# EAGLE schematic screen.sch123 (EAGLE 9.6.1)

## Sheet 1 of 4
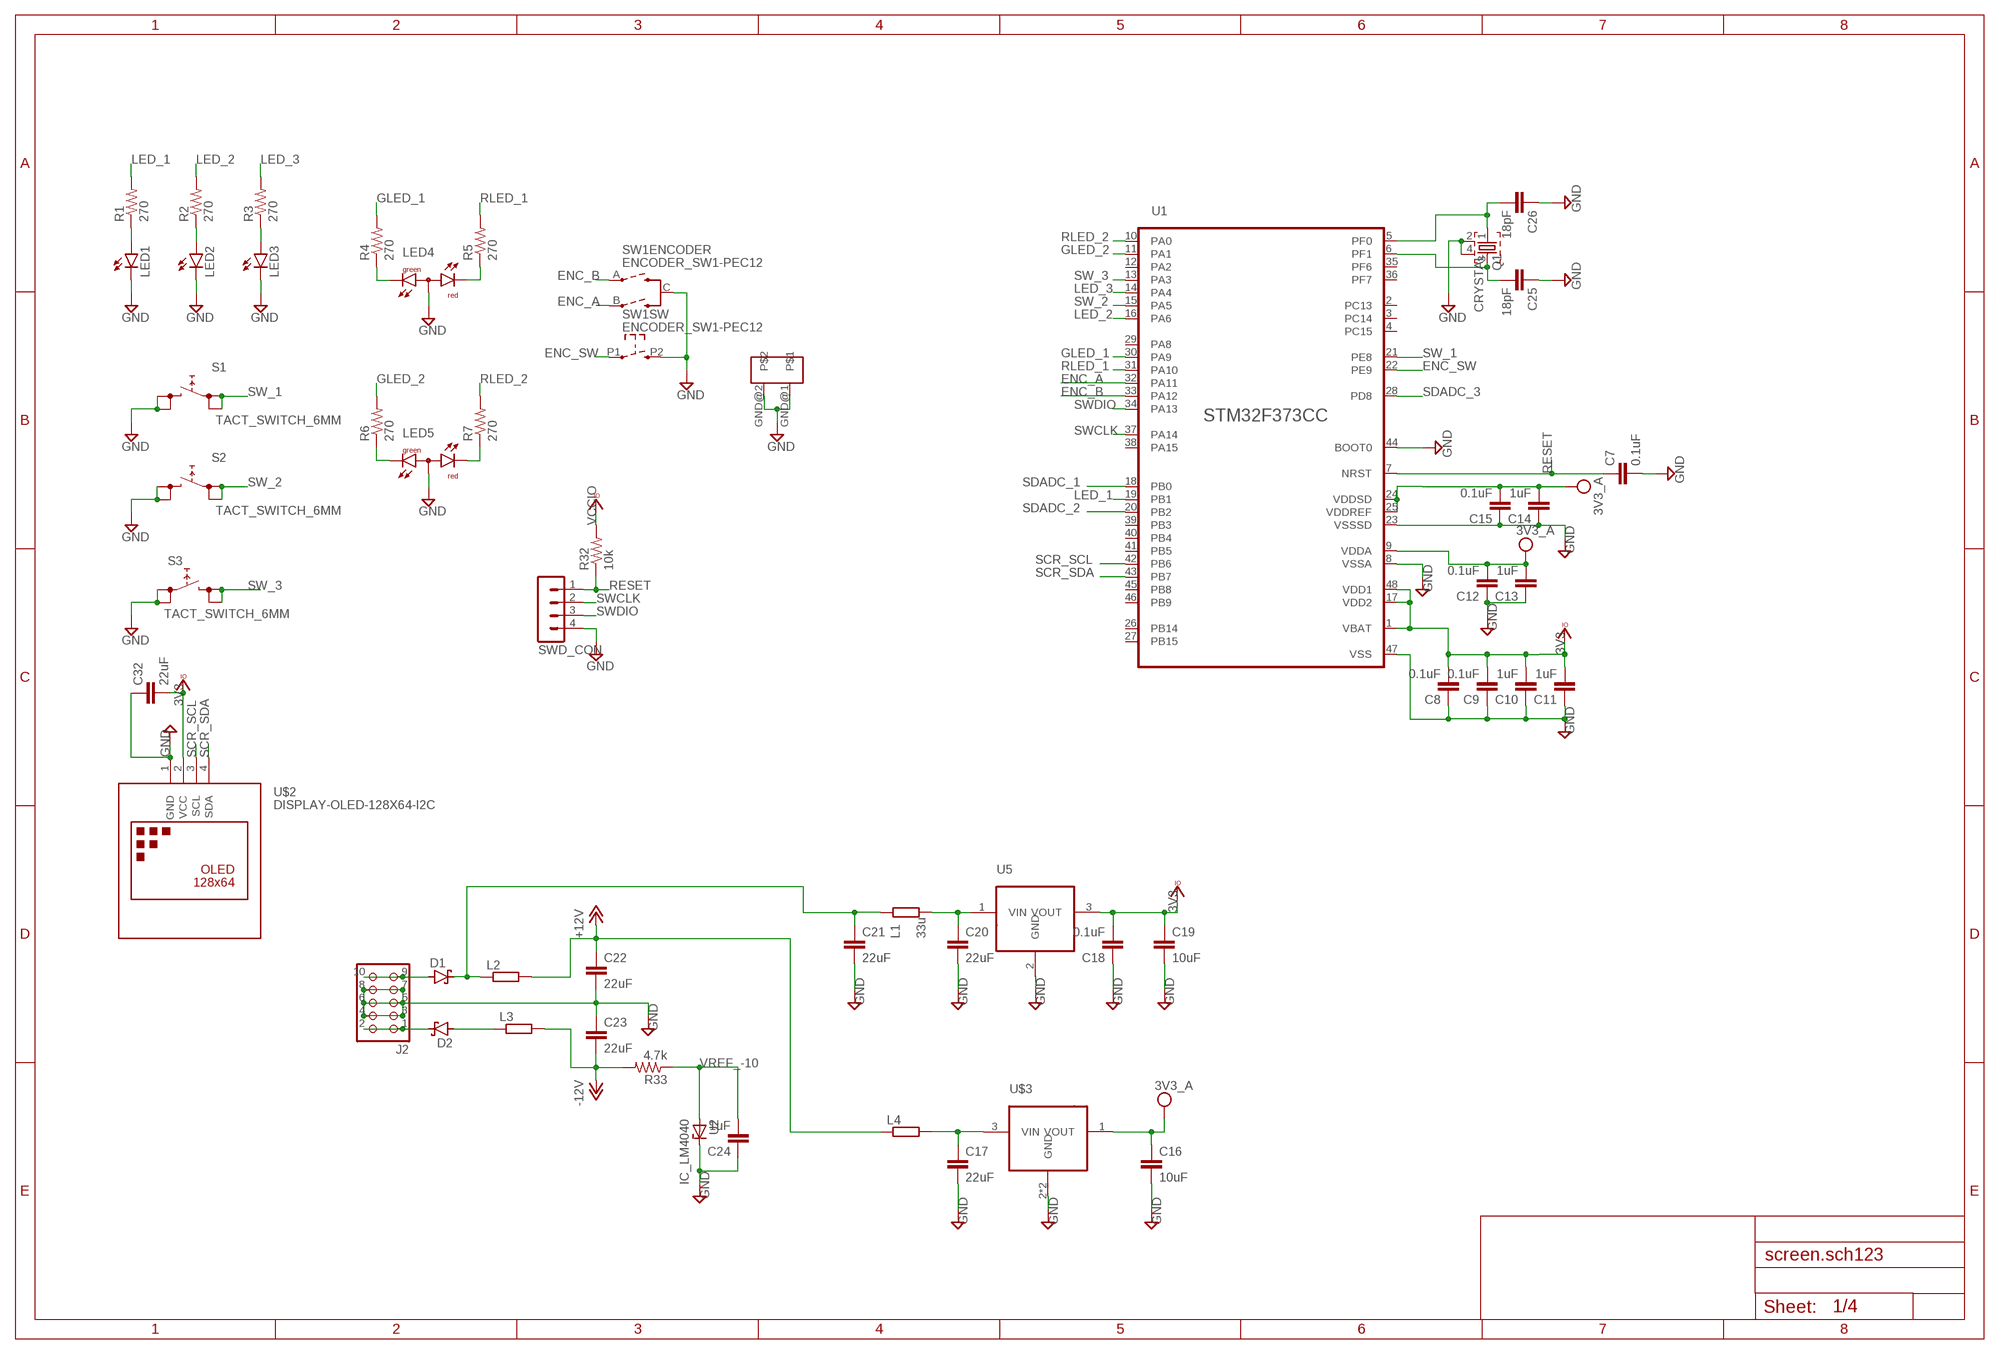
[diagram p0: schematic, sheet 1]

### Parts
C7  0.1uF  C-EUC0603  [C0603]
C8  0.1uF  C-EUC0603  [C0603]
C9  0.1uF  C-EUC0603  [C0603]
C10  1uF  C-EUC0603  [C0603]
C11  1uF  C-EUC0603  [C0603]
C12  0.1uF  C-EUC0603  [C0603]
C13  1uF  C-EUC0603  [C0603]
C14  1uF  C-EUC0603  [C0603]
C15  0.1uF  C-EUC0603  [C0603]
C16  10uF  C-EUC1206  [C1206]
C17  22uF  C-EUC1206  [C1206]
C18  0.1uF  C-EUC0603  [C0603]
C19  10uF  C-EUC1206  [C1206]
C20  22uF  C-EUC1206  [C1206]
C21  22uF  C-EUC1206  [C1206]
C22  22uF  C-EUC1206  [C1206]
C23  22uF  C-EUC1206  [C1206]
C24  1uF  C-EUC0603  [C0603]
C25  18pF  C-EUC0603  [C0603]
C26  18pF  C-EUC0603  [C0603]
C32  22uF  C-EUC1206  [C1206]
D1  SMF5.0AT1  [SOD123FL]
D2  SMF5.0AT1  [SOD123FL]
J2  CON_HEADER_2X05-PTH+SHROUDED_A  [PINSHRD_PTH_2X05]
L1  33u  R-EU_R0805  [R0805]
L2  R-EU_R0603  [R0603]
L3  R-EU_R0603  [R0603]
L4  R-EU_R0603  [R0603]
LED1  LED3MM  [LED3MM]
LED2  LED3MM  [LED3MM]
LED3  LED3MM  [LED3MM]
LED4  L-115WEGW-CA  [DUOLED-A-3MM]
LED5  L-115WEGW-CA  [DUOLED-A-3MM]
Q1  CRYSTAL  [CTS406]
R1  270  R-US_R0603  [R0603]
R2  270  R-US_R0603  [R0603]
R3  270  R-US_R0603  [R0603]
R4  270  R-US_R0603  [R0603]
R5  270  R-US_R0603  [R0603]
R6  270  R-US_R0603  [R0603]
R7  270  R-US_R0603  [R0603]
R32  10k  R-US_R0603  [R0603]
R33  4.7k  R-US_R0603  [R0603]
S1  TACT_SWITCH_6MM  [TACT_SWITCH_6MM]
S2  TACT_SWITCH_6MM  [TACT_SWITCH_6MM]
S3  TACT_SWITCH_6MM  [TACT_SWITCH_6MM]
SW1  ENCODER_SW1-PEC12  [PEC12_INCREMENTAL_ENCODER]
SWD_CON  MA04-1  [MA04-1]
U1  STM32F373LQFP48  [LQFP48]
U2  IC_LM4040  [SOT-23]
U5  R-78E-0.5  [TO-220_RECOM]
U$2  DISPLAY-OLED-128X64-I2C  [DISPLAY-OLED-128X64-I2C]
U$3  LD2981ABUSOT89  [SOT89]

### Nets
+12V: C22.1 L2.2 L4.1 ; also sheet 2,3,4
-12V: C23.2 L3.2 R33.2 ; also sheet 2,3,4
ENC_A: SW1.B(ENCODER:B) U1.32(PA11)
ENC_B: SW1.A(ENCODER:A) U1.33(PA12)
ENC_SW: SW1.P1 U1.22(PE9)
GLED_1: R4.2 U1.30(PA9)
GLED_2: R6.2 U1.11(PA1)
GND: C7.2 C8.1 C9.1 C10.1 C11.1 C12.1 C13.1 C14.1 C15.1 C16.2 C17.2 C18.1 C19.2 C20.2 C21.2 C22.2 C23.1 C24.1 C25.1 C26.1 C32.1 J2.3 J2.4 J2.5 J2.6 J2.7 J2.8 LED1.K(C) LED2.K(C) LED3.K(C) LED4.2(A) LED5.2(A) Q1.2 Q1.4 S1.P$3 S1.P$4 S2.P$3 S2.P$4 S3.P$1 S3.P$2 SW1.C(ENCODER:C) SW1.GND@1 SW1.GND@2 SW1.P2 SWD_CON.4 U1.8(VSSA) U1.23(VSSSD) U1.44(BOOT0) U1.47(VSS) U2.1(C) U5.2(GND) U$2.1(GND) U$3.2(GND) U$3.2@1(GND) ; also sheet 2,3,4
LED_1: R1.2 U1.19(PB1)
LED_2: R2.2 U1.16(PA6)
LED_3: R3.2 U1.14(PA4)
N$3: LED1.A R1.1
N$4: LED2.A R2.1
N$5: LED3.A R3.1
N$6: LED4.1(CG) R4.1
N$7: LED4.3(CR) R5.1
N$8: C25.2 Q1.3 U1.6(PF1)
N$11: D2.C J2.1 J2.2
N$12: LED5.1(CG) R6.1
N$13: LED5.3(CR) R7.1
N$26: D1.A J2.9 J2.10
N$31: C21.1 D1.C L1.1 L2.1
N$32: C26.2 Q1.1 U1.5(PF0)
N$33: C20.1 L1.2 U5.1(VIN)
N$43: C17.1 L4.2 U$3.3(VIN)
N$44: D2.A L3.1
RESET: C7.1 R32.1 SWD_CON.1 U1.7(NRST) ; also sheet 3
RLED_1: R5.2 U1.31(PA10)
RLED_2: R7.2 U1.10(PA0)
SCR_SCL: U1.42(PB6) U$2.3(SCL)
SCR_SDA: U1.43(PB7) U$2.4(SDA)
SDADC_1: U1.18(PB0) ; also sheet 2
SDADC_2: U1.20(PB2) ; also sheet 2
SDADC_3: U1.28(PD8) ; also sheet 2
SW_1: S1.P$1 S1.P$2 U1.21(PE8)
SW_2: S2.P$1 S2.P$2 U1.15(PA5)
SW_3: S3.P$3 S3.P$4 U1.13(PA3)
SWCLK: SWD_CON.2 U1.37(PA14) ; also sheet 3
SWDIO: SWD_CON.3 U1.34(PA13) ; also sheet 3
VCC: C12.2 C13.2 C14.2 C15.2 C16.1 U1.9(VDDA) U1.24(VDDSD) U1.25(VDDREF) U$3.1(VOUT) ; supply symbol labelled 3V3_A ; also sheet 2
VCCIO: C8.2 C9.2 C10.2 C11.2 C18.2 C19.1 C32.2 R32.2 U1.1(VBAT) U1.17(VDD2) U1.48(VDD1) U5.3(VOUT) U$2.2(VCC) ; supply symbol labelled 3V3 ; also sheet 3,4
VREF_-10: C24.2 R33.1 U2.2(A) U2.3(A) ; also sheet 2
Unconnected: U1.2(PC13) U1.3(PC14) U1.4(PC15) U1.12(PA2) U1.26(PB14) U1.27(PB15) U1.29(PA8) U1.35(PF6) U1.36(PF7) U1.38(PA15) U1.39(PB3) U1.40(PB4) U1.41(PB5) U1.45(PB8) U1.46(PB9)

## Sheet 2 of 4
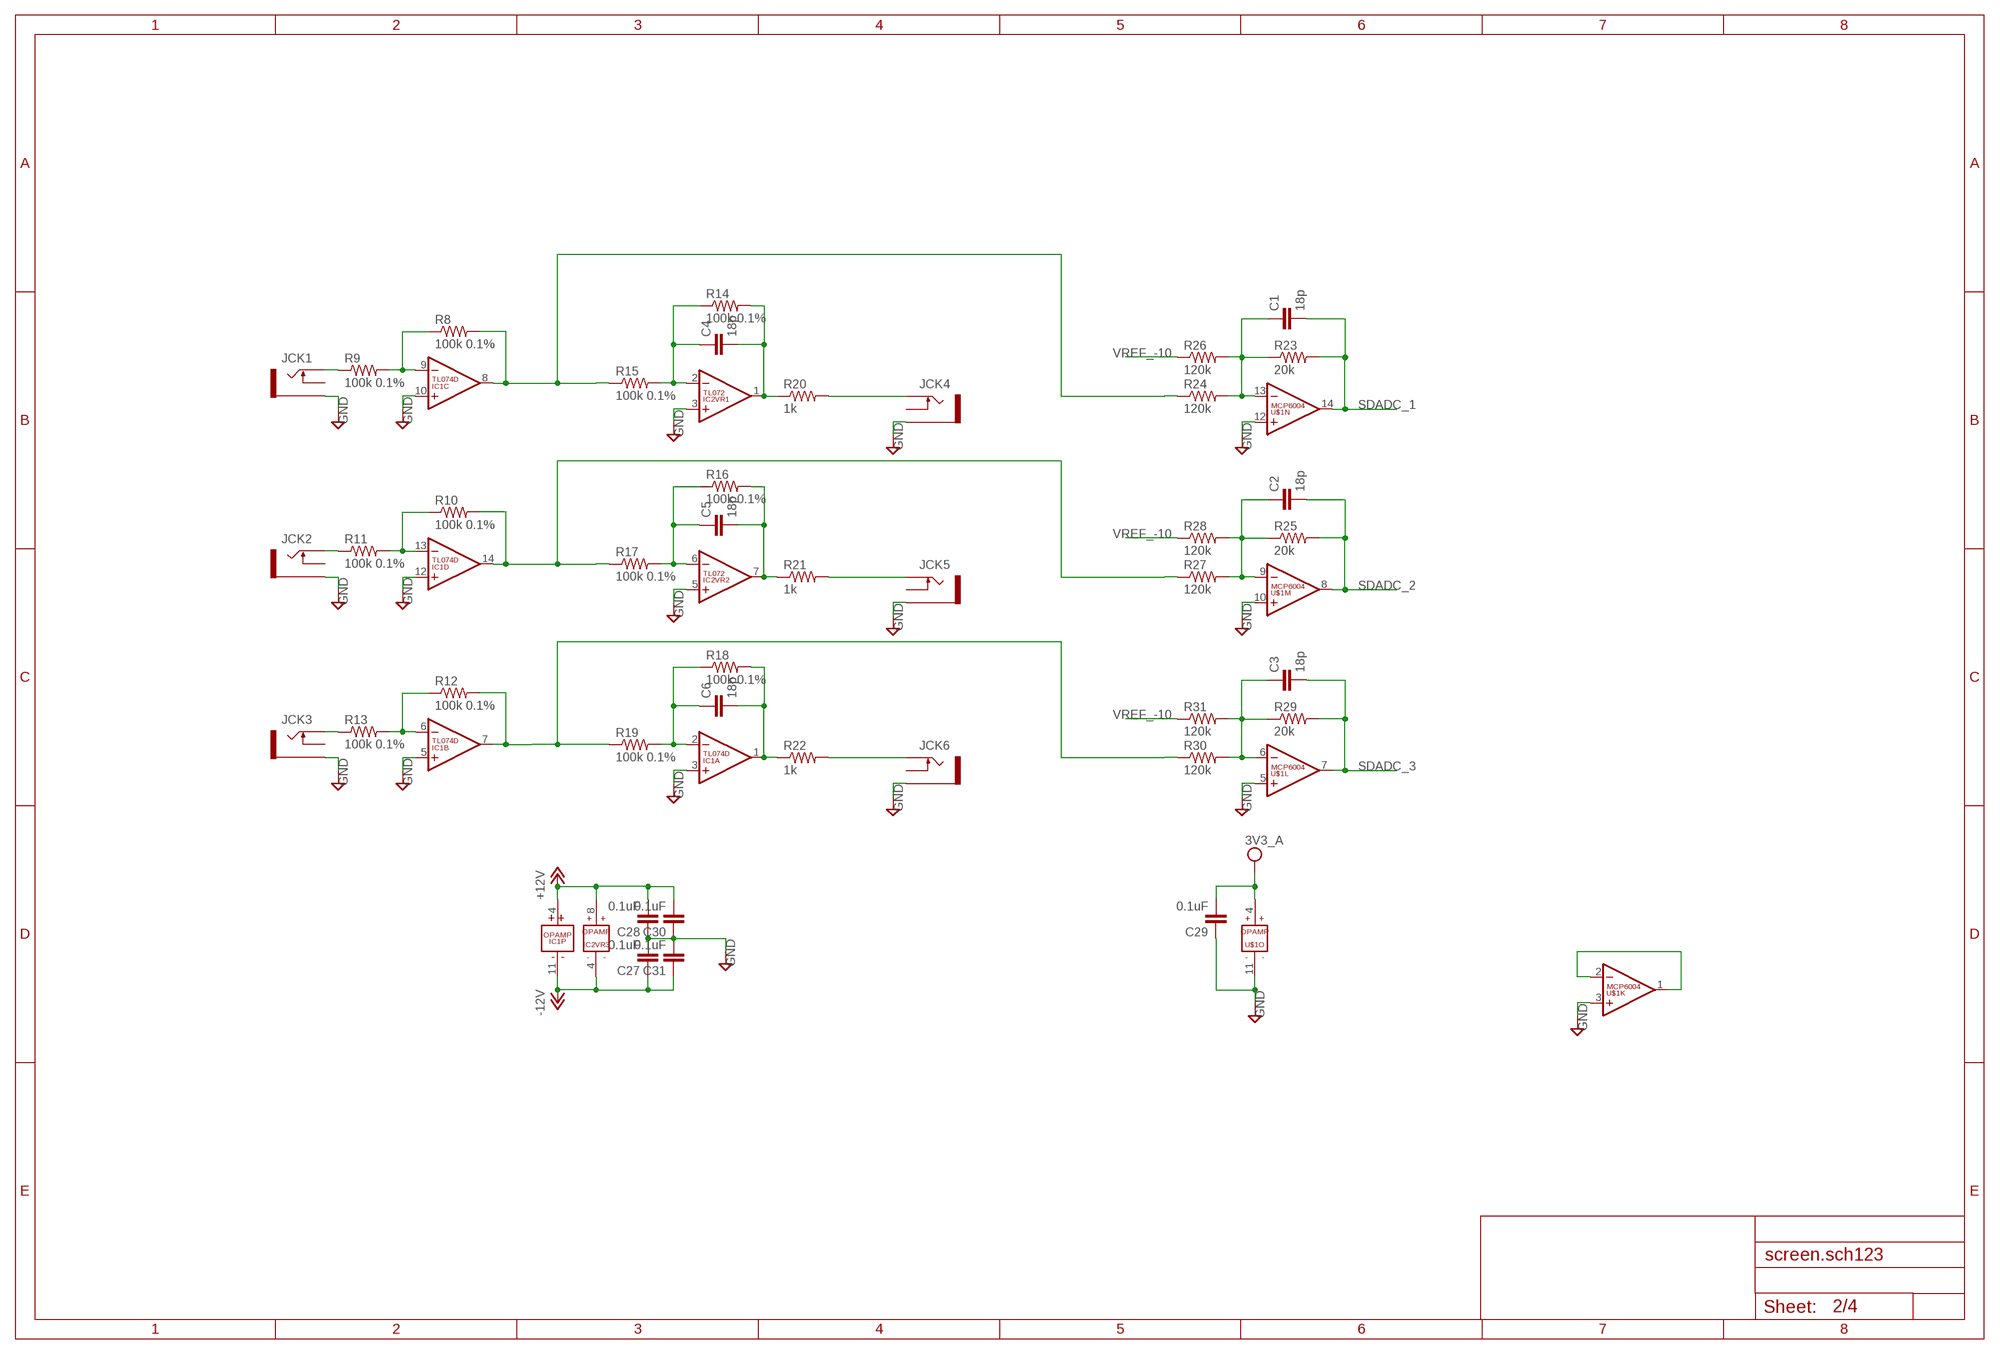
[diagram p1: schematic, sheet 2]

### Parts
C1  18p  C-EUC0603  [C0603]
C2  18p  C-EUC0603  [C0603]
C3  18p  C-EUC0603  [C0603]
C4  18p  C-EUC0603  [C0603]
C5  18p  C-EUC0603  [C0603]
C6  18p  C-EUC0603  [C0603]
C27  0.1uF  C-EUC0603  [C0603]
C28  0.1uF  C-EUC0603  [C0603]
C29  0.1uF  C-EUC0603  [C0603]
C30  0.1uF  C-EUC0603  [C0603]
C31  0.1uF  C-EUC0603  [C0603]
IC1  TL074D  [SO14]
IC2  TL072  [SO08]
JCK1  THONKICONNNEW  [WQP-PJ301M-12_JACK]
JCK2  THONKICONNNEW  [WQP-PJ301M-12_JACK]
JCK3  THONKICONNNEW  [WQP-PJ301M-12_JACK]
JCK4  THONKICONNNEW  [WQP-PJ301M-12_JACK]
JCK5  THONKICONNNEW  [WQP-PJ301M-12_JACK]
JCK6  THONKICONNNEW  [WQP-PJ301M-12_JACK]
R8  100k 0.1%  R-US_R0603  [R0603]
R9  100k 0.1%  R-US_R0603  [R0603]
R10  100k 0.1%  R-US_R0603  [R0603]
R11  100k 0.1%  R-US_R0603  [R0603]
R12  100k 0.1%  R-US_R0603  [R0603]
R13  100k 0.1%  R-US_R0603  [R0603]
R14  100k 0.1%  R-US_R0603  [R0603]
R15  100k 0.1%  R-US_R0603  [R0603]
R16  100k 0.1%  R-US_R0603  [R0603]
R17  100k 0.1%  R-US_R0603  [R0603]
R18  100k 0.1%  R-US_R0603  [R0603]
R19  100k 0.1%  R-US_R0603  [R0603]
R20  1k  R-US_R0603  [R0603]
R21  1k  R-US_R0603  [R0603]
R22  1k  R-US_R0603  [R0603]
R23  20k  R-US_R0603  [R0603]
R24  120k  R-US_R0603  [R0603]
R25  20k  R-US_R0603  [R0603]
R26  120k  R-US_R0603  [R0603]
R27  120k  R-US_R0603  [R0603]
R28  120k  R-US_R0603  [R0603]
R29  20k  R-US_R0603  [R0603]
R30  120k  R-US_R0603  [R0603]
R31  120k  R-US_R0603  [R0603]
U$1  MCP6004  [SO14]

### Nets
+12V: C28.2 C30.2 IC1.4(P:V+) IC2.8(VR3:V+) ; also sheet 1,3,4
-12V: C27.1 C31.1 IC1.11(P:V-) IC2.4(VR3:V-) ; also sheet 1,3,4
GND: C27.2 C28.1 C29.1 C30.1 C31.2 IC1.3(A:+IN) IC1.5(B:+IN) IC1.10(C:+IN) IC1.12(D:+IN) IC2.3(VR1:+IN) IC2.5(VR2:+IN) JCK1.P$3_SLEEVE(SLEEVE) JCK2.P$3_SLEEVE(SLEEVE) JCK3.P$3_SLEEVE(SLEEVE) JCK4.P$3_SLEEVE(SLEEVE) JCK5.P$3_SLEEVE(SLEEVE) JCK6.P$3_SLEEVE(SLEEVE) U$1.3(K:+IN) U$1.5(L:+IN) U$1.10(M:+IN) U$1.11(O:V-) U$1.12(N:+IN) ; also sheet 1,3,4
N$1: IC1.9(C:-IN) R8.1 R9.2
N$2: IC1.13(D:-IN) R10.1 R11.2
N$9: C6.2 IC1.1(A:OUT) R18.2 R22.1
N$10: C1.1 R23.1 R24.2 R26.2 U$1.13(N:-IN)
N$14: JCK1.P$1_TIP(TIP) R9.1
N$15: JCK2.P$1_TIP(TIP) R11.1
N$16: IC1.6(B:-IN) R12.1 R13.2
N$17: C4.2 IC2.1(VR1:OUT) R14.2 R20.1
N$18: JCK3.P$1_TIP(TIP) R13.1
N$19: C4.1 IC2.2(VR1:-IN) R14.1 R15.2
N$20: U$1.1(K:OUT) U$1.2(K:-IN)
N$21: C5.2 IC2.7(VR2:OUT) R16.2 R21.1
N$22: C5.1 IC2.6(VR2:-IN) R16.1 R17.2
N$23: C2.1 R25.1 R27.2 R28.2 U$1.9(M:-IN)
N$25: C6.1 IC1.2(A:-IN) R18.1 R19.2
N$27: C3.1 R29.1 R30.2 R31.2 U$1.6(L:-IN)
N$28: JCK5.P$1_TIP(TIP) R21.2
N$29: JCK4.P$1_TIP(TIP) R20.2
N$30: JCK6.P$1_TIP(TIP) R22.2
SDADC_1: C1.2 R23.2 U$1.14(N:OUT) ; also sheet 1
SDADC_2: C2.2 R25.2 U$1.8(M:OUT) ; also sheet 1
SDADC_3: C3.2 R29.2 U$1.7(L:OUT) ; also sheet 1
SIGNAL_1: IC1.8(C:OUT) R8.2 R15.1 R24.1
SIGNAL_2: IC1.14(D:OUT) R10.2 R17.1 R27.1
SIGNAL_3: IC1.7(B:OUT) R12.2 R19.1 R30.1
VCC: C29.2 U$1.4(O:V+) ; supply symbol labelled 3V3_A ; also sheet 1
VREF_-10: R26.1 R28.1 R31.1 ; also sheet 1
Unconnected: JCK1.P$2_SWITCH(SWITCH) JCK2.P$2_SWITCH(SWITCH) JCK3.P$2_SWITCH(SWITCH) JCK4.P$2_SWITCH(SWITCH) JCK5.P$2_SWITCH(SWITCH) JCK6.P$2_SWITCH(SWITCH)

## Sheet 3 of 4
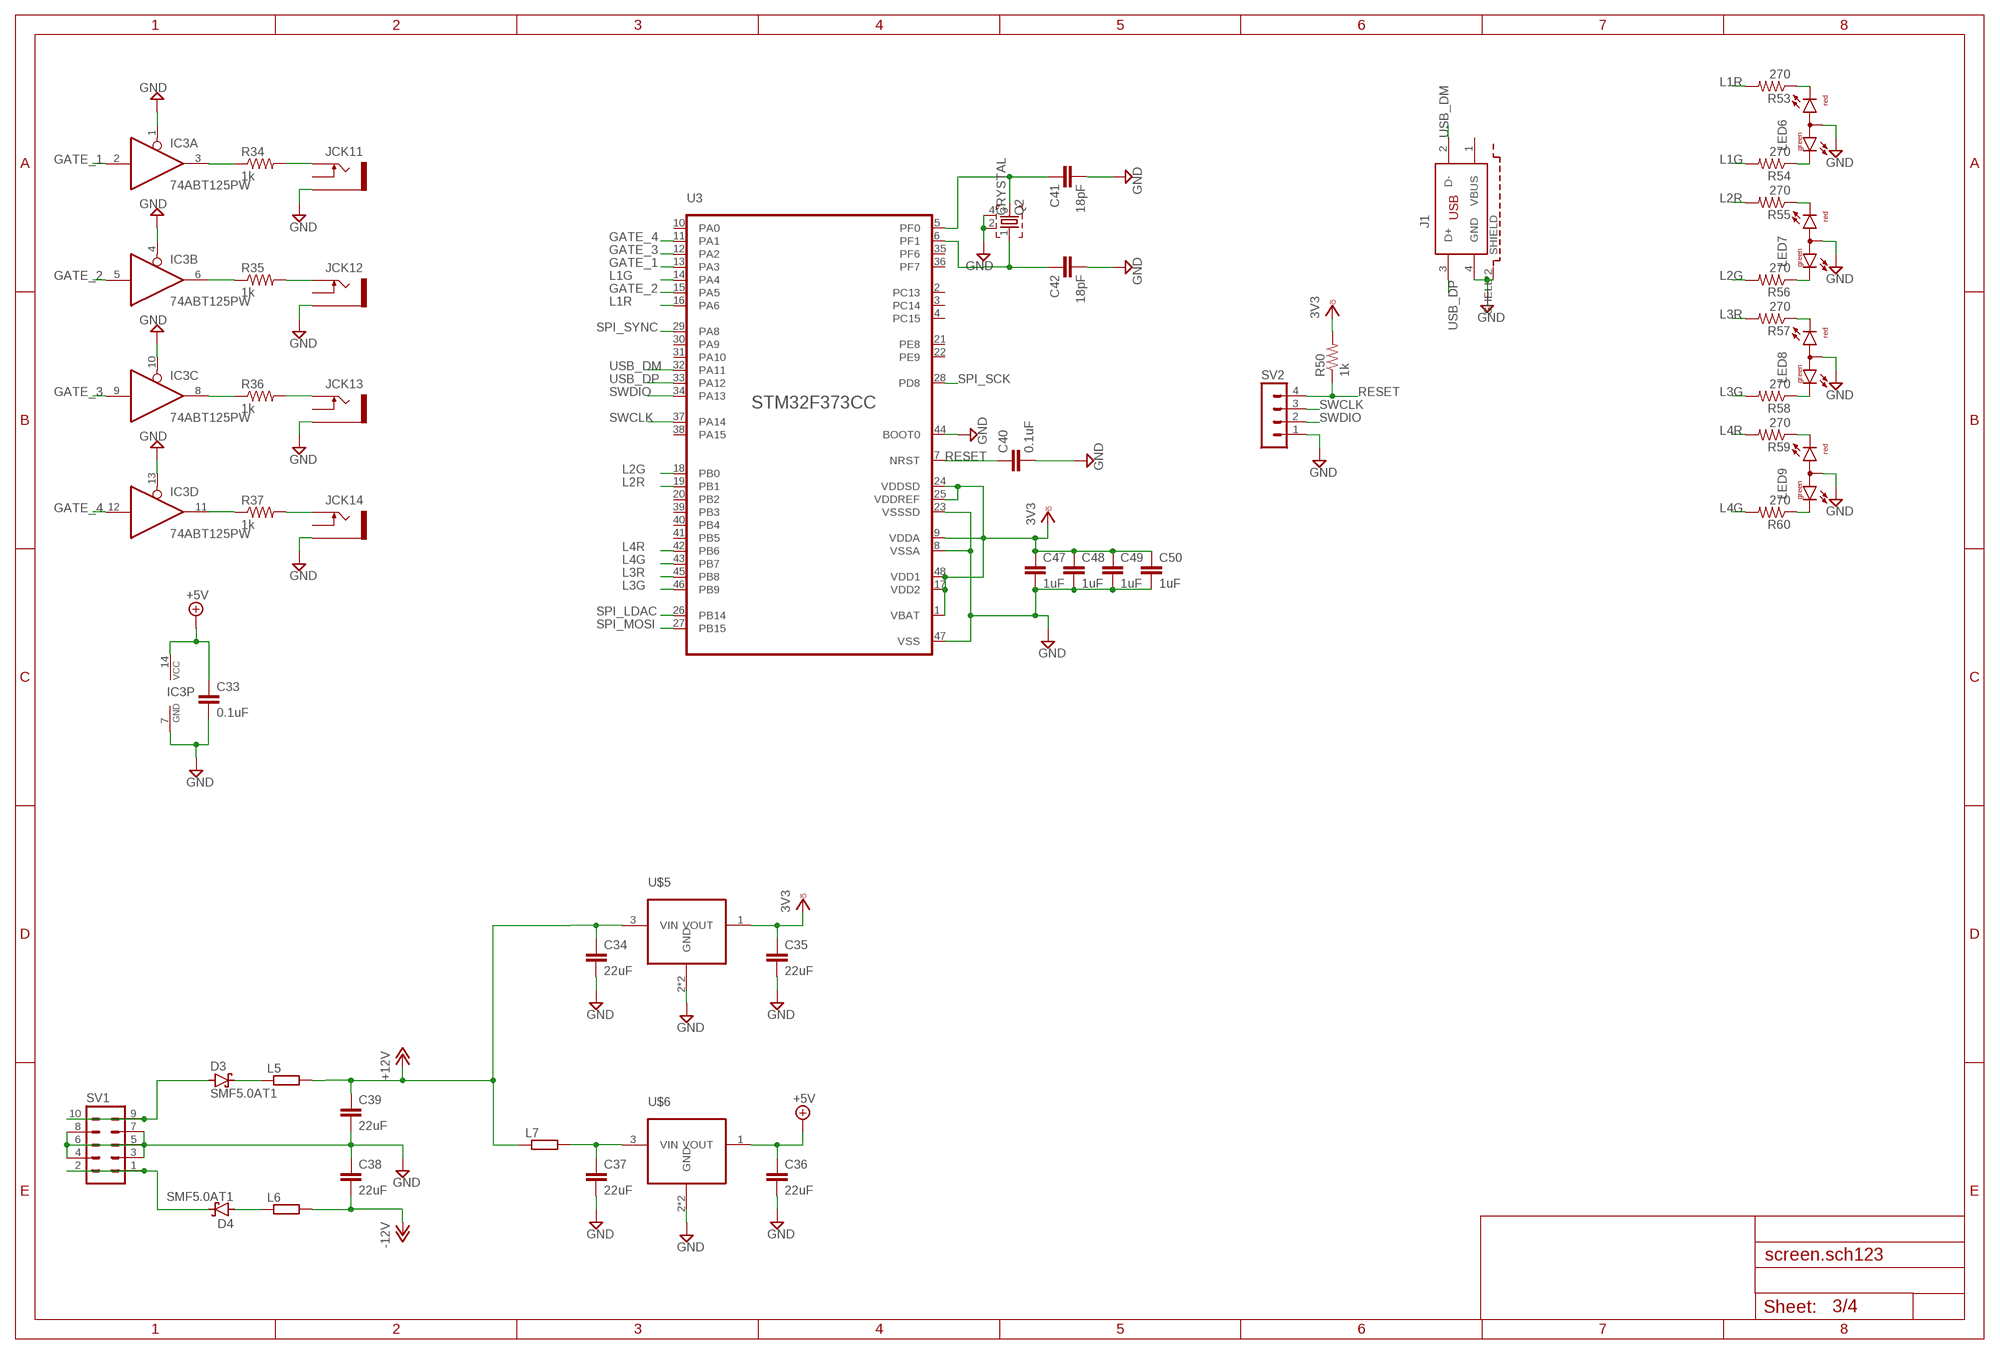
[diagram p2: schematic, sheet 3]

### Parts
C33  0.1uF  C-EUC0603K  [C0603K]
C34  22uF  C-EUC1206K  [C1206K]
C35  22uF  C-EUC1206K  [C1206K]
C36  22uF  C-EUC1206K  [C1206K]
C37  22uF  C-EUC1206K  [C1206K]
C38  22uF  C-EUC1206K  [C1206K]
C39  22uF  C-EUC1206K  [C1206K]
C40  0.1uF  C-EUC0603K  [C0603K]
C41  18pF  C-EUC0603K  [C0603K]
C42  18pF  C-EUC0603K  [C0603K]
C47  1uF  C-EUC0603K  [C0603K]
C48  1uF  C-EUC0603K  [C0603K]
C49  1uF  C-EUC0603K  [C0603K]
C50  1uF  C-EUC0603K  [C0603K]
D3  SMF5.0AT1  [SOD123FL]
D4  SMF5.0AT1  [SOD123FL]
IC3  74ABT125PW  [TSSOP14]
J1  61400413321  [61400413321]
JCK11  THONKICONNNEW  [WQP-PJ301M-12_JACK]
JCK12  THONKICONNNEW  [WQP-PJ301M-12_JACK]
JCK13  THONKICONNNEW  [WQP-PJ301M-12_JACK]
JCK14  THONKICONNNEW  [WQP-PJ301M-12_JACK]
L5  R-EU_R0603  [R0603]
L6  R-EU_R0603  [R0603]
L7  R-EU_R0603  [R0603]
LED6  L-115WEGW-CA  [DUOLED-A-3MM]
LED7  L-115WEGW-CA  [DUOLED-A-3MM]
LED8  L-115WEGW-CA  [DUOLED-A-3MM]
LED9  L-115WEGW-CA  [DUOLED-A-3MM]
Q2  CRYSTAL  [CTS406]
R34  1k  R-US_R0603  [R0603]
R35  1k  R-US_R0603  [R0603]
R36  1k  R-US_R0603  [R0603]
R37  1k  R-US_R0603  [R0603]
R50  1k  R-US_R0603  [R0603]
R53  270  R-US_R0603  [R0603]
R54  270  R-US_R0603  [R0603]
R55  270  R-US_R0603  [R0603]
R56  270  R-US_R0603  [R0603]
R57  270  R-US_R0603  [R0603]
R58  270  R-US_R0603  [R0603]
R59  270  R-US_R0603  [R0603]
R60  270  R-US_R0603  [R0603]
SV1  MA05-2  [MA05-2]
SV2  MA04-1  [MA04-1]
U3  STM32F373LQFP48  [LQFP48]
U$5  LD2981ABUSOT89  [SOT89]
U$6  LD2981ABUSOT89  [SOT89]

### Nets
+5V: C33.1 C36.1 IC3.14(P:VCC) U$6.1(VOUT) ; also sheet 4
+12V: C34.1 C39.1 L5.2 L7.1 U$5.3(VIN) ; also sheet 1,2,4
-12V: C38.2 L6.2 ; also sheet 1,2,4
GATE_1: IC3.2(A:I) U3.13(PA3)
GATE_2: IC3.5(B:I) U3.15(PA5)
GATE_3: IC3.9(C:I) U3.12(PA2)
GATE_4: IC3.12(D:I) U3.11(PA1)
GND: C33.2 C34.2 C35.2 C36.2 C37.2 C38.1 C39.2 C40.2 C41.2 C42.2 C47.2 C48.2 C49.2 C50.2 IC3.1(A:OE) IC3.4(B:OE) IC3.7(P:GND) IC3.10(C:OE) IC3.13(D:OE) J1.4(GND) J1.SHELL1(SHIELD) J1.SHELL(SHIELD) JCK11.P$3_SLEEVE(SLEEVE) JCK12.P$3_SLEEVE(SLEEVE) JCK13.P$3_SLEEVE(SLEEVE) JCK14.P$3_SLEEVE(SLEEVE) LED6.2(A) LED7.2(A) LED8.2(A) LED9.2(A) Q2.2 Q2.4 SV1.3 SV1.4 SV1.5 SV1.6 SV1.7 SV1.8 SV2.1 U3.8(VSSA) U3.23(VSSSD) U3.44(BOOT0) U3.47(VSS) U$5.2(GND) U$5.2@1(GND) U$6.2(GND) U$6.2@1(GND) ; also sheet 1,2,4
L1G: R54.2 U3.14(PA4)
L1R: R53.2 U3.16(PA6)
L2G: R56.2 U3.18(PB0)
L2R: R55.2 U3.19(PB1)
L3G: R58.2 U3.46(PB9)
L3R: R57.2 U3.45(PB8)
L4G: R60.2 U3.43(PB7)
L4R: R59.2 U3.42(PB6)
N$24: IC3.3(A:O) R34.1
N$34: IC3.6(B:O) R35.1
N$35: IC3.8(C:O) R36.1
N$36: IC3.11(D:O) R37.1
N$37: JCK11.P$1_TIP(TIP) R34.2
N$38: JCK12.P$1_TIP(TIP) R35.2
N$39: JCK13.P$1_TIP(TIP) R36.2
N$40: JCK14.P$1_TIP(TIP) R37.2
N$41: C37.1 L7.2 U$6.3(VIN)
N$42: D3.C L5.1
N$45: D4.A L6.1
N$46: D4.C SV1.1 SV1.2
N$47: D3.A SV1.9 SV1.10
N$48: LED7.1(CG) R56.1
N$49: LED7.3(CR) R55.1
N$50: LED6.1(CG) R54.1
N$51: LED6.3(CR) R53.1
N$52: LED9.3(CR) R59.1
N$53: LED9.1(CG) R60.1
N$54: LED8.1(CG) R58.1
N$55: LED8.3(CR) R57.1
N$56: C42.1 Q2.1 U3.6(PF1)
N$57: C41.1 Q2.3 U3.5(PF0)
RESET: C40.1 R50.1 SV2.4 U3.7(NRST) ; also sheet 1
SPI_LDAC: U3.26(PB14) ; also sheet 4
SPI_MOSI: U3.27(PB15) ; also sheet 4
SPI_SCK: U3.28(PD8) ; also sheet 4
SPI_SYNC: U3.29(PA8) ; also sheet 4
SWCLK: SV2.3 U3.37(PA14) ; also sheet 1
SWDIO: SV2.2 U3.34(PA13) ; also sheet 1
USB_DM: J1.2(D-) U3.32(PA11)
USB_DP: J1.3(D+) U3.33(PA12)
VCCIO: C35.1 C47.1 C48.1 C49.1 C50.1 R50.2 U3.1(VBAT) U3.9(VDDA) U3.17(VDD2) U3.24(VDDSD) U3.25(VDDREF) U3.48(VDD1) U$5.1(VOUT) ; supply symbol labelled 3V3 ; also sheet 1,4
Unconnected: J1.1(VBUS) JCK11.P$2_SWITCH(SWITCH) JCK12.P$2_SWITCH(SWITCH) JCK13.P$2_SWITCH(SWITCH) JCK14.P$2_SWITCH(SWITCH) U3.2(PC13) U3.3(PC14) U3.4(PC15) U3.10(PA0) U3.20(PB2) U3.21(PE8) U3.22(PE9) U3.30(PA9) U3.31(PA10) U3.35(PF6) U3.36(PF7) U3.38(PA15) U3.39(PB3) U3.40(PB4) U3.41(PB5)

## Sheet 4 of 4
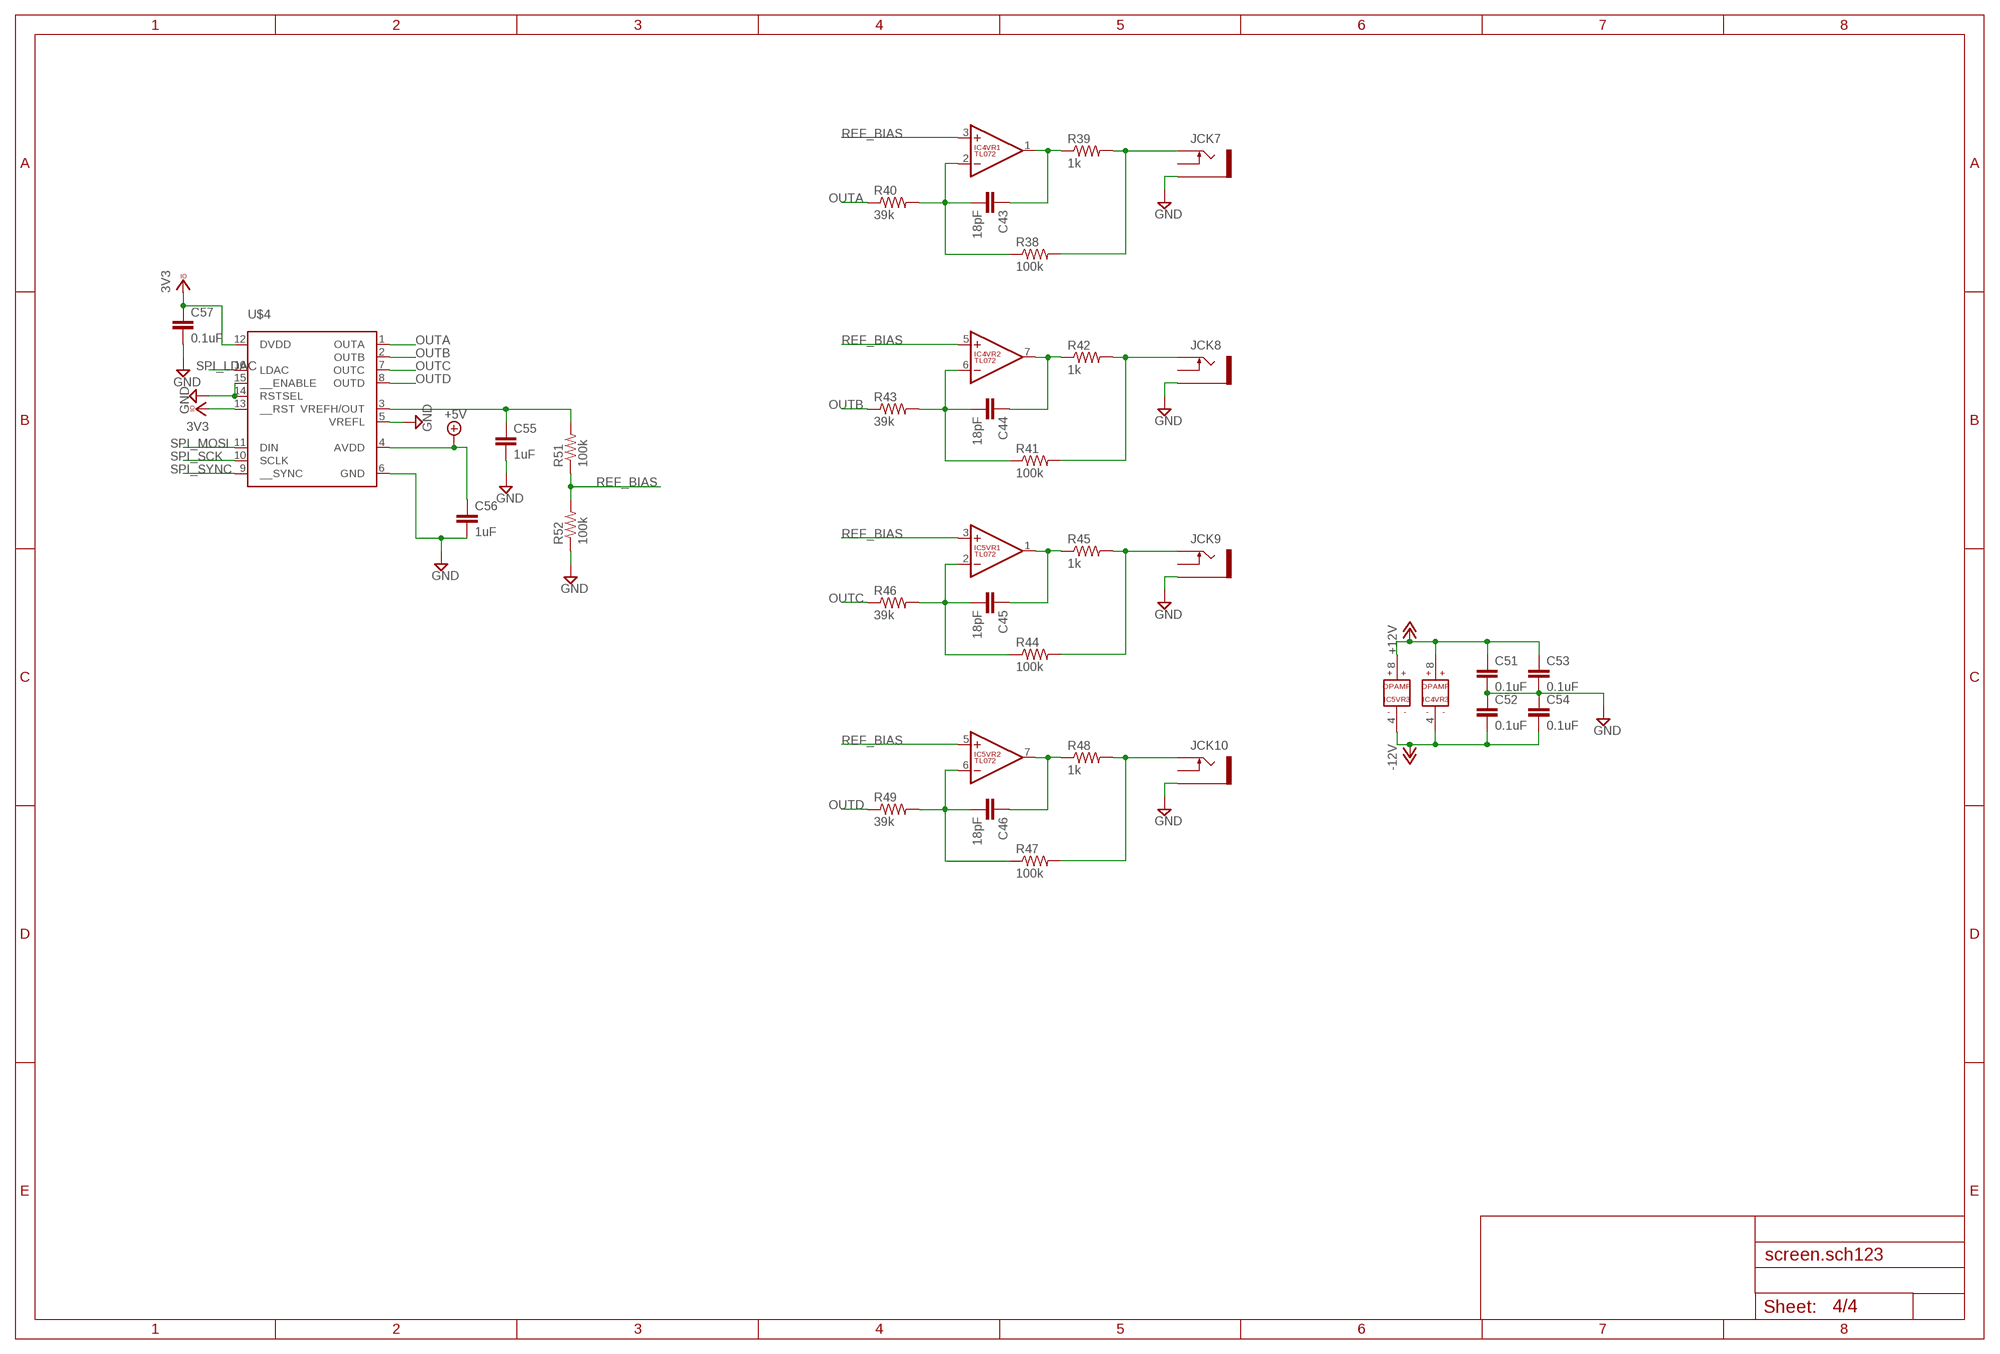
[diagram p3: schematic, sheet 4]

### Parts
C43  18pF  C-EUC0603K  [C0603K]
C44  18pF  C-EUC0603K  [C0603K]
C45  18pF  C-EUC0603K  [C0603K]
C46  18pF  C-EUC0603K  [C0603K]
C51  0.1uF  C-EUC0603K  [C0603K]
C52  0.1uF  C-EUC0603K  [C0603K]
C53  0.1uF  C-EUC0603K  [C0603K]
C54  0.1uF  C-EUC0603K  [C0603K]
C55  1uF  C-EUC0603K  [C0603K]
C56  1uF  C-EUC0603K  [C0603K]
C57  0.1uF  C-EUC0603K  [C0603K]
IC4  TL072  [SO08]
IC5  TL072  [SO08]
JCK7  THONKICONNNEW  [WQP-PJ301M-12_JACK]
JCK8  THONKICONNNEW  [WQP-PJ301M-12_JACK]
JCK9  THONKICONNNEW  [WQP-PJ301M-12_JACK]
JCK10  THONKICONNNEW  [WQP-PJ301M-12_JACK]
R38  100k  R-US_R0603  [R0603]
R39  1k  R-US_R0603  [R0603]
R40  39k  R-US_R0603  [R0603]
R41  100k  R-US_R0603  [R0603]
R42  1k  R-US_R0603  [R0603]
R43  39k  R-US_R0603  [R0603]
R44  100k  R-US_R0603  [R0603]
R45  1k  R-US_R0603  [R0603]
R46  39k  R-US_R0603  [R0603]
R47  100k  R-US_R0603  [R0603]
R48  1k  R-US_R0603  [R0603]
R49  39k  R-US_R0603  [R0603]
R51  100k  R-US_R0603  [R0603]
R52  100k  R-US_R0603  [R0603]
U$4  DAC8565  [TSSOP16]

### Nets
+5V: C56.1 U$4.4(AVDD) ; also sheet 3
+12V: C51.1 C53.1 IC4.8(VR3:V+) IC5.8(VR3:V+) ; also sheet 1,2,3
-12V: C52.2 C54.2 IC4.4(VR3:V-) IC5.4(VR3:V-) ; also sheet 1,2,3
GND: C51.2 C52.1 C53.2 C54.1 C55.2 C56.2 C57.2 JCK7.P$3_SLEEVE(SLEEVE) JCK8.P$3_SLEEVE(SLEEVE) JCK9.P$3_SLEEVE(SLEEVE) JCK10.P$3_SLEEVE(SLEEVE) R52.1 U$4.5(VREFL) U$4.6(GND) U$4.14(RSTSEL) U$4.15(__ENABLE) ; also sheet 1,2,3
N$58: C43.2 IC4.2(VR1:-IN) R38.1 R40.2
N$59: C43.1 IC4.1(VR1:OUT) R39.1
N$60: JCK7.P$1_TIP(TIP) R38.2 R39.2
N$61: C44.2 IC4.6(VR2:-IN) R41.1 R43.2
N$62: C44.1 IC4.7(VR2:OUT) R42.1
N$63: JCK8.P$1_TIP(TIP) R41.2 R42.2
N$64: C45.2 IC5.2(VR1:-IN) R44.1 R46.2
N$65: C45.1 IC5.1(VR1:OUT) R45.1
N$66: JCK9.P$1_TIP(TIP) R44.2 R45.2
N$67: C46.2 IC5.6(VR2:-IN) R47.1 R49.2
N$68: C46.1 IC5.7(VR2:OUT) R48.1
N$69: JCK10.P$1_TIP(TIP) R47.2 R48.2
N$70: C55.1 R51.2 U$4.3(VREFH/OUT)
OUTA: R40.1 U$4.1(OUTA)
OUTB: R43.1 U$4.2(OUTB)
OUTC: R46.1 U$4.7(OUTC)
OUTD: R49.1 U$4.8(OUTD)
REF_BIAS: IC4.3(VR1:+IN) IC4.5(VR2:+IN) IC5.3(VR1:+IN) IC5.5(VR2:+IN) R51.1 R52.2
SPI_LDAC: U$4.16(LDAC) ; also sheet 3
SPI_MOSI: U$4.11(DIN) ; also sheet 3
SPI_SCK: U$4.10(SCLK) ; also sheet 3
SPI_SYNC: U$4.9(__SYNC) ; also sheet 3
VCCIO: C57.1 U$4.12(DVDD) U$4.13(__RST) ; supply symbol labelled 3V3 ; also sheet 1,3
Unconnected: JCK7.P$2_SWITCH(SWITCH) JCK8.P$2_SWITCH(SWITCH) JCK9.P$2_SWITCH(SWITCH) JCK10.P$2_SWITCH(SWITCH)

## Library data of the parts
C1-C57 = resistor:C-EU: CAPACITOR, European symbol
D1-D4 = diode:SMF5.0AT1: 200 W Transient Voltage Suppressor Source: Data sheet <http://www.onsemi.com/pub_link/Collateral/SMF5.0AT1-D.PDF>
IC1 = EurorackModularParts:TL074: OP AMP
IC2 IC4 IC5 = EurorackModularParts:TL072
IC3 = 74xx-eu:74*125: Quad bus BUFFER, 3-state
J1 = Wurth_Elektronik_Electromechanic_Input-Output_Connectors_rev19a:61400413321: WR-COM Vertical USB Type B,4 pins=>Code : Con_I-O_COM_USB-2.0_B_61400413321 <http://katalog.we-online.de/media/images/v2/Family_S290_WR-COM_USB_TypeB_61400413321_4C.jpg> Details see: http://katalog.we-online.de/en/em/COM_TYPE_B_VERTICAL Created 2014-07-09, Karrer Zheng 2014 (C) Würth Elektronik
J2 = dp_devices:CON_HEADER_2X05: 2x05 pin header
JCK1-JCK14 = BitFox:THONKICONN: 3.5mm socket for Eurorack modular synths
L1-L7 = resistor:R-EU_: RESISTOR, European symbol
LED1-LED3 = led:LED: LED OSRAM: - CHIPLED LG R971, LG N971, LY N971, LG Q971, LY Q971, LO R971, LY R971 LH N974, LH R974 LS Q976, LO Q976, LY Q976 LO Q996 - Hyper CHIPLED LW Q18S LB Q993, LB Q99A, LB R99A - SideLED LS A670, LO A670, LY A670, LG A670, LP A670 LB A673, LV A673, LT A673, LW A673 LH A674 LY A675 LS A676, LA A676, LO A676, LY A676, LW A676 LS A679, LY A679, LG A679 - Hyper Micro SIDELED® LS Y876, LA Y876, LO Y876, LY Y876 LT Y87S - SmartLED LW L88C, LW L88S LB L89C, LB L89S, LG L890 LS L89K, LO L89K, LY L89K LS L896, LA L896, LO L896, LY L896 - TOPLED LS T670, LO T670, LY T670, LG T670, LP T670 LSG T670, LSP T670, LSY T670, LOP T670, LYG T670 LG T671, LOG T671, LSG T671 LB T673, LV T673, LT T673, LW T673 LH T674 LS T676, LA T676, LO T676, LY T676, LB T676, LH T676, LSB T676, LW T676 LB T67C, LV T67C, LT T67C, LS T67K, LO T67K, LY T67K, LW E67C LS E67B, LA E67B, LO E67B, LY E67B, LB E67C, LV E67C, LT E67C LW T67C LS T679, LY T679, LG T679 LS T770, LO T770, LY T770, LG T770, LP T770 LB T773, LV T773, LT T773, LW T773 LH T774 LS E675, LA E675, LY E675, LS T675 LS T776, LA T776, LO T776, LY T776, LB T776 LHGB T686 LT T68C, LB T68C - Hyper Mini TOPLED® LB M676 - Mini TOPLED Santana® LG M470 LS M47K, LO M47K, LY M47K Source: http://www.osram.convergy.de LUXEON: - LUMILED® LXK2-PW12-R00, LXK2-PW12-S00, LXK2-PW14-U00, LXK2-PW14-V00 LXK2-PM12-R00, LXK2-PM12-S00, LXK2-PM14-U00 LXK2-PE12-Q00, LXK2-PE12-R00, LXK2-PE12-S00, LXK2-PE14-T00, LXK2-PE14-U00 LXK2-PB12-K00, LXK2-PB12-L00, LXK2-PB12-M00, LXK2-PB14-N00, LXK2-PB14-P00, LXK2-PB14-Q00 LXK2-PR12-L00, LXK2-PR12-M00, LXK2-PR14-Q00, LXK2-PR14-R00 LXK2-PD12-Q00, LXK2-PD12-R00, LXK2-PD12-S00 LXK2-PH12-R00, LXK2-PH12-S00 LXK2-PL12-P00, LXK2-PL12-Q00, LXK2-PL12-R00 Source: www.luxeon.com KINGBRIGHT: KA-3528ASYC Source: www.kingbright.com
LED4-LED9 = led:L-115WEGW-CA: T-1(3mm) BI-COLOR INDICATOR LAMP Source: Kingbright .. 2_colour_led_.pdf
Q1 Q2 = BitFox:CRYSTAL
R1-R60 = resistor:R-US_: RESISTOR, American symbol
S1-S3 = BitFox:TACT_SWITCH_6MM
SV1 = con-lstb:MA05-2: PIN HEADER; OC_FARNELL: unknown; OC_NEWARK: unknown
SV2 SWD_CON = con-lstb:MA04-1: PIN HEADER; OC_FARNELL: unknown; OC_NEWARK: unknown
SW1 = dp_devices.v6:ENCODER_SW1: Incremental Encoder with push switch
U1 U3 = BitFox:STM32F373
U2 = dp_devices.v6:IC_LM4040: LM4040 Precision Micropower Shunt Voltage Reference
U5 = BitFox:R-78E-0.5
U$1 = EurorackModularParts:MCP6004
U$2 = diy-modules:DISPLAY-OLED-128X64-I2C: 128x64 Dot Matrix OLED Module based on SSD1306 chip Variant with I2C interface More details available here: http://www.instructables.com/id/Monochrome-096-i2c-OLED-display-with-arduino-SSD13/ SSD1306 datasheet: https://cdn-shop.adafruit.com/datasheets/SSD1306.pdf Click here to find device on ebay.com <http://www.ebay.com/sch/oled+display+128x64+iic> Note: There are two variants: I2C and SPI. Search for the proper version.
U$3 U$5 U$6 = BitFox:LD2981ABU
U$4 = BitFox:DAC8565